# Altium schematic sheet Charger600mnt.SchDoc
size 420 x 297 mm; Address1: Address1; Address2: Address2; Address3: Address3; Address4: Address4; SheetNumber: 1; Scale: 1:1; Обозначение документа: АБВГ.123456.001 Э3
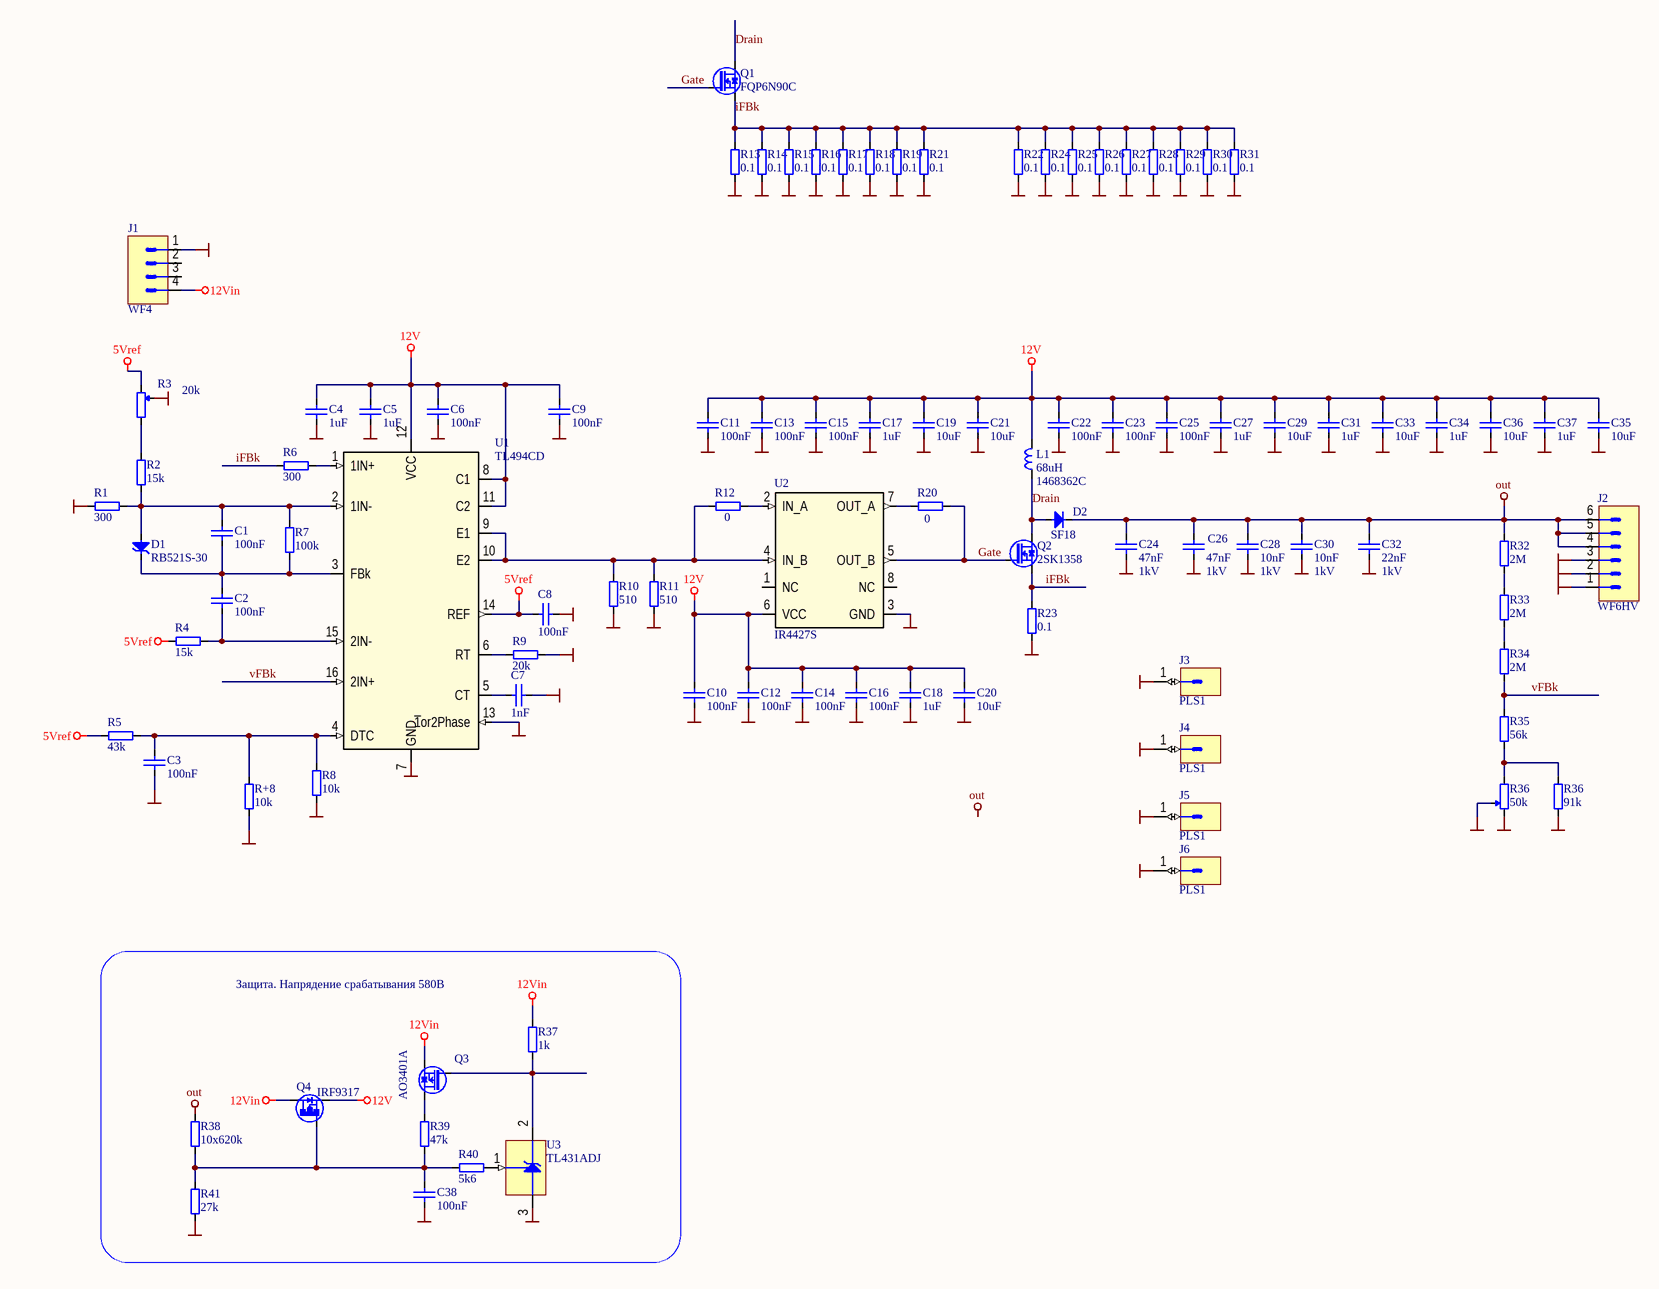
[diagram p0: Charger600mnt.SchDoc]

## Parts
(Parts that share a designator on the sheet are numbered #1, #2 ... from top to bottom, then left to right.)
C1  100nF  [CAPC1608X87N]
C2  100nF  [CAPC1608X87N]
C3  100nF  [CAPC1608X87N]
C4  1uF  [SMD0805CAP]
C5  1uF  [SMD0805CAP]
C6  100nF  [CAPC1608X87N]
C7  1nF  [CAPC1608X87N]
C8  100nF  [CAPC1608X87N]
C9  100nF  [CAPC1608X87N]
C10  100nF  [CAPC1608X87N]
C11  100nF  [CAPC1608X87N]
C12  100nF  [CAPC1608X87N]
C13  100nF  [CAPC1608X87N]
C14  100nF  [CAPC1608X87N]
C15  100nF  [CAPC1608X87N]
C16  100nF  [CAPC1608X87N]
C17  1uF  [SMD0805CAP]
C18  1uF  [SMD0805CAP]
C19  10uF  [CAPC1206]
C20  10uF  [CAPC1206]
C21  10uF  [CAPC1206]
C22  100nF  [CAPC1608X87N]
C23  100nF  [CAPC1608X87N]
C24  47nF  Voltage: 1kV  [CAPR2750-900X3150X1900]
C25  100nF  [CAPC1608X87N]
C26  47nF  Voltage: 1kV  [CAPR2750-900X3150X1900]
C27  1uF  [SMD0805CAP]
C28  10nF  Voltage: 1kV  [CAPR1500-900X1800X1750]
C29  10uF  [CAPC1206]
C30  10nF  Voltage: 1kV  [CAPR1500-900X1800X1750]
C31  1uF  [SMD0805CAP]
C32  22nF  Voltage: 1kV  [CAPR2250-900X2600X1850]
C33  10uF  [CAPC1206]
C34  1uF  [SMD0805CAP]
C35  10uF  [CAPC1206]
C36  10uF  [CAPC1206]
C37  1uF  [SMD0805CAP]
C38  100nF  [CAPC1608X87N]
D1  RB521S-30  [SODFL1608X65N]
D2  SF18  [DIOAD1397W120L700D400]
J1  WF4  [WF4_2_54]
J2  WF6HV  [MOLEX_WF6HV]
J3  PLS1  [PLS1]
J4  PLS1  [PLS1]
J5  PLS1  [PLS1]
J6  PLS1  [PLS1]
L1  68uH  [muR1468362C]
Q1  FQP6N90C  [TO-220-v]
Q2  2SK1358  [TO-247-v]
Q3  AO3401A  [SOT95P229X119-3N]
Q4  IRF9317  [SOT95P229X119-3N]
R1  300  [RESC1608X64N]
R2  15k  [RESC1608X64N]
R3  20k  [TRIM_BOURNS_3296Y]
R4  15k  [RESC1608X64N]
R5  43k  [RESC1608X64N]
R6  300  [RESC1608X64N]
R7  100k  [RESC1608X64N]
R8  10k  [RESC1608X64N]
R9  20k  [RESC1608X64N]
R10  510  [RESC3016X65N]
R11  510  [RESC3016X65N]
R12  0  [RESC1608X64N]
R13  0.1  [SMD0805RES]
R14  0.1  [SMD0805RES]
R15  0.1  [SMD0805RES]
R16  0.1  [SMD0805RES]
R17  0.1  [SMD0805RES]
R18  0.1  [SMD0805RES]
R19  0.1  [SMD0805RES]
R20  0  [RESC1608X64N]
R21  0.1  [SMD0805RES]
R22  0.1  [RESC3016X65N]
R23  0.1  [SMD0805RES]
R24  0.1  [RESC3016X65N]
R25  0.1  [RESC3016X65N]
R26  0.1  [RESC3016X65N]
R27  0.1  [RESC3016X65N]
R28  0.1  [RESC3016X65N]
R29  0.1  [RESC3016X65N]
R30  0.1  [RESC3016X65N]
R31  0.1  [RESC3016X65N]
R32  2M  [RES1016-360X210]
R33  2M  [RES1016-360X210]
R34  2M  [RES1016-360X210]
R35  56k  [RESC1608X64N]
R36#1  50k  [TRIM_BOURNS_3296Y]
R36#2  91k  [RESC1608X64N]
R37  1k  [RESC1608X64N]
R38  10x620k  [RES1016-360X210]
R39  47k  [RESC1608X64N]
R40  5k6  [RESC1608X64N]
R41  27k  [RESC1608X64N]
R+8  10k  [RESC1608X64N]
U1  TL494CD  [SOIC127P780X200-16N]
U2  IR4427S  [SOIC127P600X175-8N]
U3  TL431ADJ  [SOT95P229X119-3N]

## Blocks framed on the sheet
Защита. Напрядение срабатывания 580В: C38 Q3 Q4 R37-R41 U3

## Nets
5Vref: C8.2 R3.1 R4.2 R5.2 U1.14(REF)
12V: C4.2 C5.2 C6.2 C9.2 C10.2 C11.2 C12.2 C13.2 C14.2 C15.2 C16.2 C17.2 C18.2 C19.2 C20.2 C21.2 C22.2 C23.2 C25.2 C27.2 C29.2 C31.2 C33.2 C34.2 C35.2 C36.2 C37.2 L1.2 Q4.2(S) U1.8(C1) U1.11(C2) U1.12(VCC) U2.6(VCC)
12Vin: J1.4 Q3.2(S) Q4.3(D) R37.2
GND: C3.1 C4.1 C5.1 C6.1 C7.1 C8.1 C9.1 C10.1 C11.1 C12.1 C13.1 C14.1 C15.1 C16.1 C17.1 C18.1 C19.1 C20.1 C21.1 C22.1 C23.1 C24.1 C25.1 C26.1 C27.1 C28.1 C29.1 C30.1 C31.1 C32.1 C33.1 C34.1 C35.1 C36.1 C37.1 C38.1 J1.1 J2.1 J2.2 J2.3 J3.1 J4.1 J5.1 J6.1 R1.2 R3.2(W) R8.1 R9.1 R10.1 R11.1 R13.1 R14.1 R15.1 R16.1 R17.1 R18.1 R19.1 R21.1 R22.1 R23.1 R24.1 R25.1 R26.1 R27.1 R28.1 R29.1 R30.1 R31.1 R36#1.1 R36#1.2(W) R36#2.1 R41.1 R+8.1 U1.7(GND) U1.13(~{1}or2Phase) U2.3(GND) U3.3(Anode)
out: C24.2 C26.2 C28.2 C30.2 C32.2 D2.1(C) J2.4 J2.5 J2.6 R32.2 R38.2
Drain: D2.2(A) L1.1 Q1.2(D) Q2.2(D)
Gate: Q1.1(G) Q2.1(G) R20.2 U2.5(OUT_B)
iFBk: Q1.3(S) Q2.3(S) R6.2 R13.2 R14.2 R15.2 R16.2 R17.2 R18.2 R19.2 R21.2 R22.2 R23.2 R24.2 R25.2 R26.2 R27.2 R28.2 R29.2 R30.2 R31.2
vFBk: R34.1 R35.2 U1.16(2IN+)
NetC1_1: C1.1 C2.2 D1.1(C) R7.1 U1.3(FBk)
NetC1_2: C1.2 D1.2(A) R1.1 R2.1 R7.2 U1.2(1IN-)
NetC2_1: C2.1 R4.1 U1.15(2IN-)
NetC3_2: C3.2 R5.1 R8.2 R+8.2 U1.4(DTC)
NetC7_2: C7.2 U1.5(CT)
NetC38_2: C38.2 Q4.1(G) R38.1 R39.1 R40.2 R41.2
NetQ3_1: Q3.1(G) R37.1 U3.2(Cathode)
NetQ3_3: Q3.3(D) R39.2
NetR2_2: R2.2 R3.3
NetR6_1: R6.1 U1.1(1IN+)
NetR9_2: R9.2 U1.6(RT)
NetR10_2: R10.2 R11.2 R12.1 U1.9(E1) U1.10(E2) U2.4(IN_B)
NetR12_2: R12.2 U2.2(IN_A)
NetR20_1: R20.1 U2.7(OUT_A)
NetR32_1: R32.1 R33.2
NetR33_1: R33.1 R34.2
NetR35_1: R35.1 R36#1.3 R36#2.2
NetR40_1: R40.1 U3.1(REF)

Not connected (* = marked no-connect by the designer): J1 2 3; U2 1(NC) 8(NC)

## Notes on the sheet
- Labels drawn without touching a wire or pin: out
- Перв. примен.
- Справ. №
- Подп. и дата
- Инв. № дубл.
- Взам. инв. №
- Разраб.
- Изм.
- Лист
- № докум.
- Подп.
- Дата
- Лит.
- Масса
- Масштаб
- Пров.
- Т.контр.
- Листов
- Инв. № подл.
- Утв.
- Н.контр.
- Копировал
- Формат А3

## Library data of the parts
C1-C3 C6-C16 C22 C23 C25 C38 = C0603: Чип конденсатор 0603; Voltage: 50V; Vendor: Vishay; DielectricType: X5R; SMD Solders: 2; Solder Option: RM; Tolerance: 20%; Pkg: SMD0603; Device: Cap603; Price: 2
  C1-C3 C6 C8-C16 C22 C23 C25 C38: Value: 100nF
  C7: Value: 1nF
C4 C5 C17 C18 C27 C31 C34 C37 = C0805: Чип конденсатор 0805; Voltage: 25V; Vendor: Vishay; DielectricType: X5R; SMD Solders: 2; Solder Option: RM; Tolerance: 20%; Pkg: SMD0805; Device: Cap0805; Value: 1uF; Price: 2
C19-C21 C29 C33 C35 C36 = C1206: Чип конденсатор 1206; Voltage: 25V; Vendor: Vishay; DielectricType: X5R; SMD Solders: 2; Solder Option: RM; Tolerance: 1%; Pkg: SMD1206; Device: Cap1206; Value: 10uF; Price: 2
C24 C26 = CBB81: HV THD capacitor; Vendor: Neon; SMD Solders: 0; Solder Option: RM; Tolerance: +-10%; Pkg: 15mm; Value: 47nF; Price: 50; Device: CBB81
C28 C30 = CK45-B3AD: HV THD capacitor; Vendor: TDK; SMD Solders: 0; Solder Option: RM; Tolerance: +-10%; Pkg: 15mm; Device: CK45-E3AD; Value: 10nF; Price: 50
C32 = CT-81: HV THD capacitor; SMD Solders: 0; Solder Option: RM; Tolerance: +-10%; Pkg: 15mm; Device: CT81; Value: 22nF; Price: 50
D1 = RB521S-30: Чип Шоттки диод; Vendor: CTK; Voltage: 30V; SMD Solders: 2; Solder Option: RM; Pkg: SOD523; Price: 5; Device: RB521S-30; Name to order: RB521S-30
D2 = SF18: HV fast diode; Vendor: Shenzhen Luguang Electronic Technology; Voltage: 800; SMD Solders: 2; Solder Option: RM; Pkg: DO41; Price: 10; Device: SF18; Name to order: SF18
J1 = WF4: Вилка  WF4; Vendor: Confly; SMD Solders: 0; Solder Option: RM; THD Solders: 4; Price: 20; Device: WF4
J2 = WF6HV: Вилка  WF6 HV; Vendor: Confly; SMD Solders: 0; Solder Option: RM; THD Solders: 6; Price: 20; Device: WF6HV
J3-J6 = PLS1: Штырь PLS1; Vendor: Confly; SMD Solders: 0; Solder Option: RM; THD Solders: 1; Price: 1; Device: PLS1
L1 = 1468362С: THD inductor; Vendor: muRata; SMD Solders: 0; Solder Option: RM; Tolerance: 20%; THD Solders: 2; Price: 600; Value: 68uH; Device: 1468362С
Q1 = FQP6N90C: NMOS; Vendor: On Semiconductor; Pkg: TO220; SMD Solders: 0; Solder Option: RM; THD Solders: 3; Voltage: 900V; Price: 250; Device: FQP6N90C; Name to order: FQP6N90C
Q2 = 2SK1358: NMOS; Vendor: Inchange; Pkg: TO247; SMD Solders: 0; Solder Option: RM; THD Solders: 3; Voltage: 900V; Price: 500; Device: 2SK1358; Name to order: 2SK1358
Q3 Q4 = AO3401A: PMOS; Vendor: UMW; Pkg: SOT23; SMD Solders: 3; Solder Option: RM; THD Solders: 0; Voltage: -30V; Price: 10; Name to order: AO3401A
  Q3: Device: AO3401A
  Q4: Device: IRF9317
R1 R2 R4-R9 R12 R20 R35 R36#2 R37 R39-R41 R+8 = R0603: Чип резистор 0603; Vendor: Vishay; SMD Solders: 2; Solder Option: RM; TC: 100ppm/C; Tolerance: 1%; Pkg: SMD0603; Pwr: 60mW; Device: Res603; Price: 2
  R1 R6: Value: 300
  R2 R4: Value: 15k
  R5: Value: 43k
  R7: Value: 100k
  R8 R+8: Value: 10k
  R9: Value: 20k
  R12 R20: Value: 0
  R35: Value: 56k
  R36#2: Value: 91k
  R37: Value: 1k
  R39: Value: 47k
  R40: Value: 5k6
  R41: Value: 27k
R3 R36#1 = 3296: Trimmer Potentiometer; Vendor: Bourns; SMD Solders: 0; Solder Option: RM; TC: 100ppm/C; Pkg: Bourns3296; Pwr: 250mW; Device: 3296Y; THD Solders: 3; Price: 200
  R3: Value: 20k
  R36#1: Value: 50k
R10 R11 R22 R24-R31 = R1206: Чип резистор 1206; Vendor: Vishay; SMD Solders: 2; Solder Option: RM; TC: 100ppm/C; Tolerance: 1%; Pkg: SMD1206; Pwr: 250mW; Device: Res1206; Price: 2
  R10 R11: Value: 510
  R22 R24-R31: Value: 0.1
R13-R19 R21 R23 = R0805: Чип резистор 0805; Vendor: Vishay; SMD Solders: 2; Solder Option: RM; TC: 100ppm/C; Tolerance: 1%; Pkg: SMD0805; Pwr: 125mW; Device: Res0805; Price: 2; Value: 0.1
R32-R34 R38 = CF-1/4W: 250mW THD resistor; Vendor: CCO; SMD Solders: 0; Solder Option: RM; TC: 100ppm/C; Tolerance: 1%; THD Solders: 2; Price: 2; Pkg: RES1016-360X210; Pwr: 250mW; Device: CF-1/4W
  R32-R34: Value: 2M
  R38: Value: 10x620k
U1 = TL494: PWM Controller; Vendor: Texas Instruments; Pkg: SOIC16; SMD Solders: 16; Solder Option: RM; THD Solders: 0; Name to order: TL494CD, TL494ID; Current: 8mA; PkgCode: CD; Price: 200; Device: TL494; thVoltage: -
U2 = IR4427: Double low side non inverting MOSFET driver; Vendor: International Rectifier; Pkg: SOIC8; SMD Solders: 8; Solder Option: RM; THD Solders: 0; Current: 200uA; PkgCode: S; Price: 260; Device: IR4427; Name to order: IR4427; thVoltage: -
U3 = TL431: Shunt reference; Vendor: Analog Devoces; Value: ADJ; Pkg: SOT23-5; SMD Solders: 5; Solder Option: RM; Price: 100; Device: TL431